# EAGLE design pH_to_I2C_v20 (EAGLE 7.2.0)
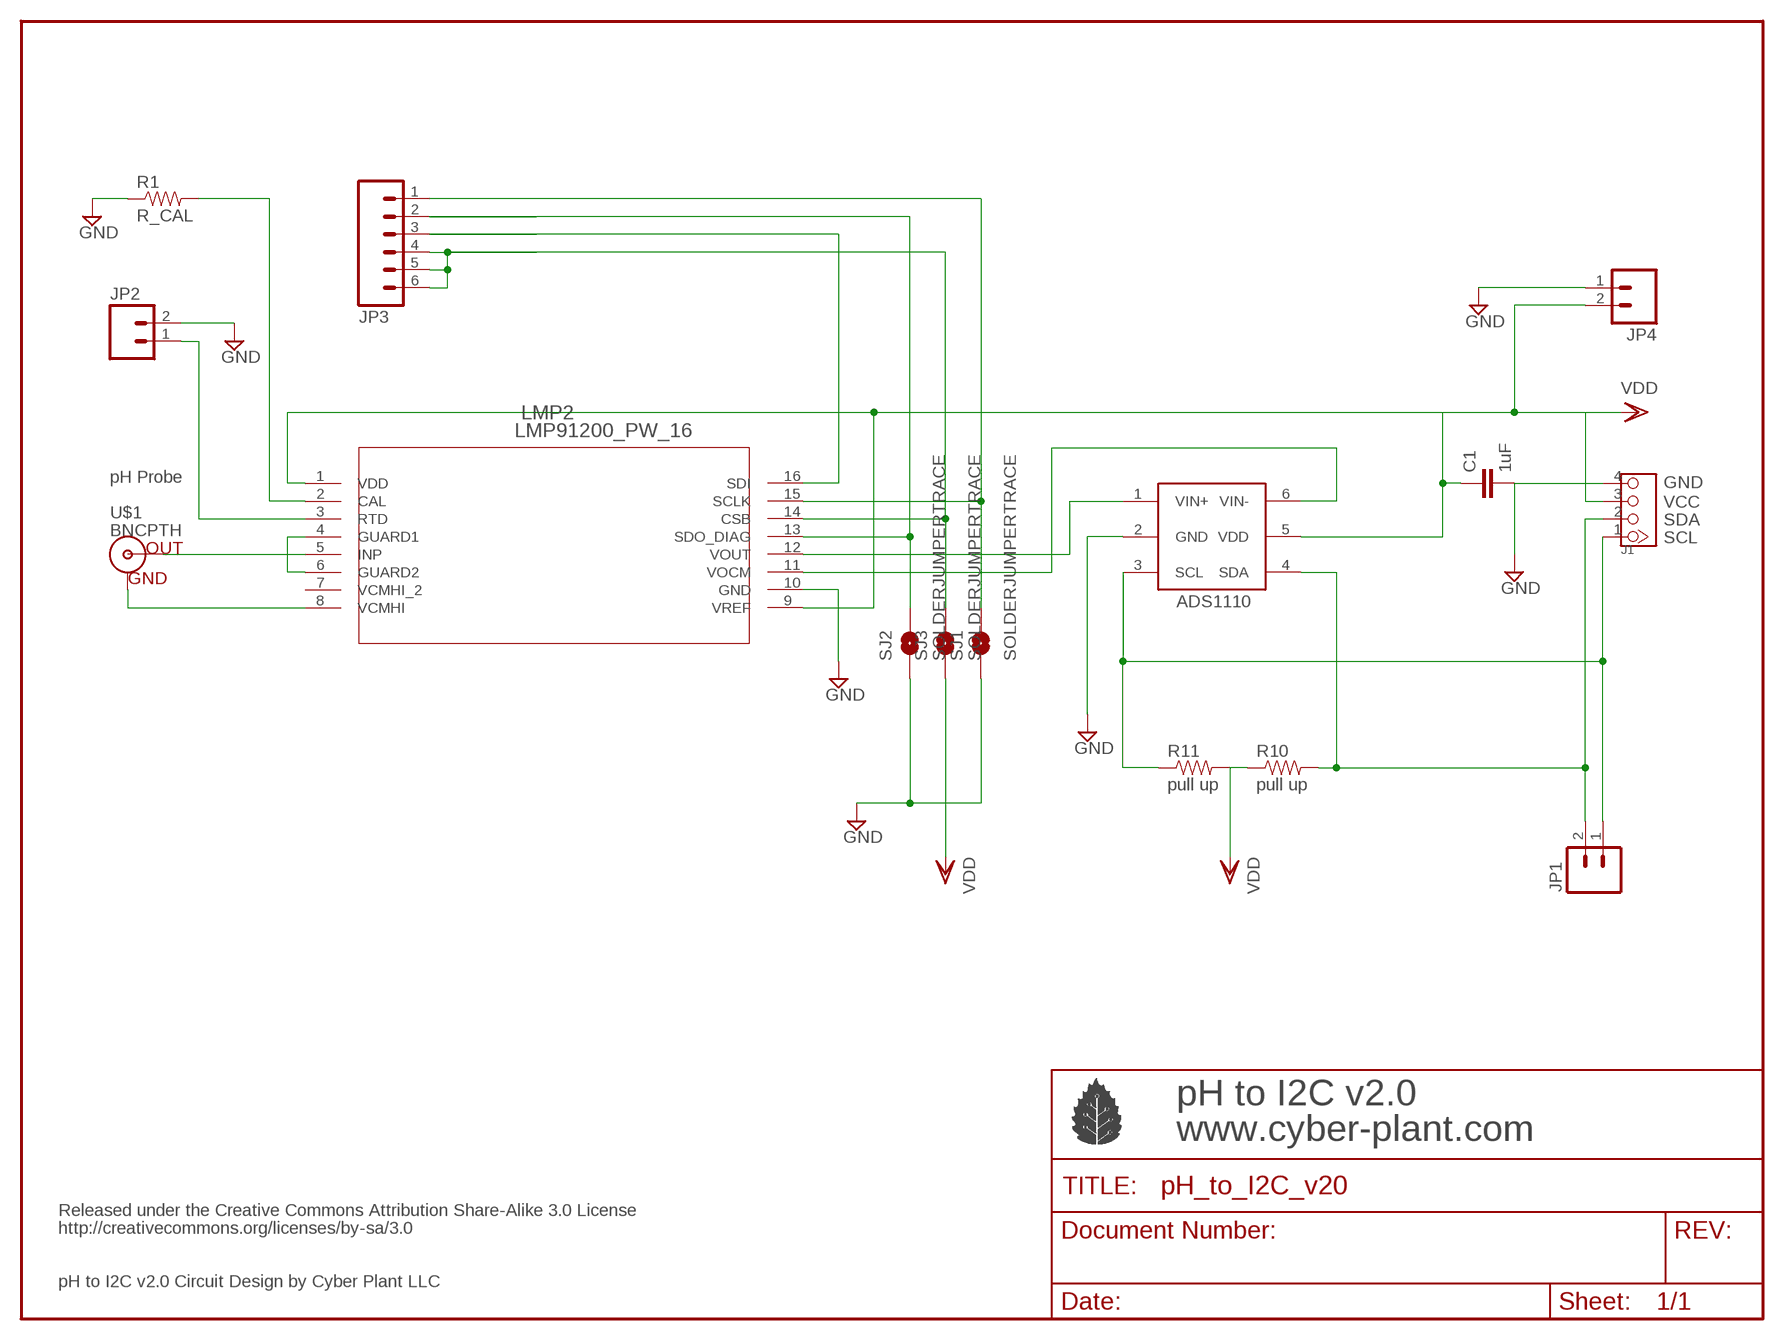
[diagram p0: schematic, sheet 1]

## Parts
C1  1uF  CAP1206  [1206]
IC1  ADS1110  [SOT-23-6]
J1  TWIG-4P-2.090D  [4P-2.0-90D]
JP1  M02PTH  [1X02]
JP2  M02PTH  [1X02]
JP3  M06SIP  [1X06]
JP4  M02PTH  [1X02]
LMP2  LMP91200_PW_16  [MTC16]
R1  R_CAL  RESISTORPTH-1/4W  [AXIAL-0.4]
R10  pull up  RESISTORPTH-1/4W  [AXIAL-0.4]
R11  pull up  RESISTORPTH-1/4W  [AXIAL-0.4]
SJ1  SOLDERJUMPERTRACE  [SJ_2S-TRACE]
SJ2  SOLDERJUMPERTRACE  [SJ_2S-TRACE]
SJ3  SOLDERJUMPERTRACE  [SJ_2S-TRACE]
U$1  BNCPTH  [BNC]

## Nets
GND: C1.2 IC1.2(GND) J1.4 JP2.2 JP4.1 LMP2.10(GND) R1.P$1 SJ1.1 SJ2.1
N$1: JP3.1 LMP2.15(SCLK) SJ1.2
N$2: JP3.2 LMP2.13(SDO_DIAG) SJ2.2
N$3: IC1.4(SDA) J1.2 JP1.2 R10.P$2
N$4: IC1.1(VIN+) LMP2.12(VOUT)
N$5: IC1.6(VIN-) LMP2.11(VOCM)
N$6: IC1.3(SCL) J1.1 JP1.1 R11.P$1
N$13: JP3.4 JP3.5 JP3.6 LMP2.14(CSB) SJ3.2
N$14: JP2.1 LMP2.3(RTD)
N$15: LMP2.8(VCMHI) U$1.GND
N$16: LMP2.5(INP) U$1.S(OUT)
N$17: LMP2.2(CAL) R1.P$2
N$18: LMP2.4(GUARD1) LMP2.6(GUARD2)
N$19: JP3.3 LMP2.16(SDI)
VDD: C1.1 IC1.5(VDD) J1.3 JP4.2 LMP2.1(VDD) LMP2.9(VREF) R10.P$1 R11.P$2 SJ3.1
Unconnected: LMP2.7(VCMHI_2)

## Notes on the sheet
- pH Probe
- GND
- VCC
- SDA
- SCL
- pH to I2C v2.0
- www.cyber-plant.com
- Released under the Creative Commons Attribution Share-Alike 3.0 License
- http://creativecommons.org/licenses/by-sa/3.0
- pH to I2C v2.0 Circuit Design by Cyber Plant LLC

## Library data of the parts
C1 = SparkFun:CAP: Capacitor Standard 0603 ceramic capacitor, and 0.1" leaded capacitor.
IC1 = ads11xx:ADS1110: Analog/Digital conventer i2c Bus max: 2.048v
J1 = Connector_cp:TWIG-4P-2.0
JP1 JP2 JP4 = SparkFun:M02: Header 2 Standard 2-pin 0.1" header. Use with straight break away headers (SKU : PRT-00116), right angle break away headers (PRT-00553), swiss pins (PRT-00743), machine pins (PRT-00117), and female headers (PRT-00115). Molex polarized connector foot print use with SKU : PRT-08233 with associated crimp pins and housings.
JP3 = SparkFun:M06: Header 6 Standard 6-pin 0.1" header. Use with straight break away headers (SKU : PRT-00116), right angle break away headers (PRT-00553), swiss pins (PRT-00743), machine pins (PRT-00117), and female headers (PRT-00115). Molex polarized connector foot print use with SKU : PRT-08094 with associated crimp pins and housings. NOTES ON THE VARIANTS LOCK and LOCK_LONGPADS... This footprint was designed to help hold the alignment of a through-hole component (i.e. 6-pin header) while soldering it into place. You may notice that each hole has been shifted either up or down by 0.005 of an inch from it's more standard position (which is a perfectly straight line). This slight alteration caused the pins (the squares in the middle) to touch the edges of the holes. Because they are alternating, it causes a "brace" to hold the component in place. 0.005 has proven to be the perfect amount of "off-center" position when using our standard breakaway headers. Although looks a little odd when you look at the bare footprint, once you have a header in there, the alteration is very hard to notice. Also, if you push a header all the way into place, it is covered up entirely on the bottom side. This idea of altering the position of holes to aid alignment will be further integrated into the Sparkfun Library for other footprints. It can help hold any component with 3 or more connection pins.
LMP2 = LMP91200:LMP91200_PW_16; BASEPN: LMP91200; DATASHEETURL: http://www.ti.com/lit/ds/symlink/lmp91200.pdf; DESCRIPTION: Configurable AFE for Low-Power Chemical Sensing Applications; MANUFACTURER: Texas Instruments; MANUFACTURER_PART_NUMBER: lmp91200_pw_16; NSC_PACKAGEREFERENCE: MTC16; VENDOR: Texas Instruments
R1 R10 R11 = SparkFun:RESISTOR: Resistor Basic schematic elements and footprints for 0603, 1206, and PTH resistors.; PROD_ID: RES-00824
SJ1-SJ3 = SparkFun:SOLDERJUMPER: Solder Jumper Standard SMD solder jumper. Used to automate production. Two varients : Normally Open and Normally Closed are the same, but have different paste layers. NC will have a large amount of paste and should jumper during reflow.
U$1 = SparkFun:BNC: BNC Connector, Mouser Part# 5227161

## Board
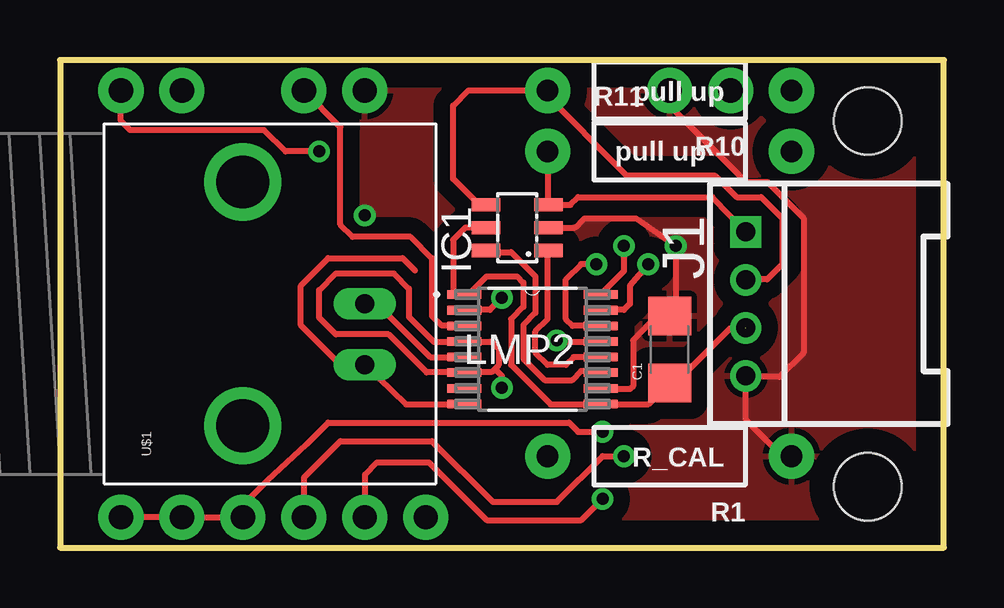
[diagram p1: board, top side]
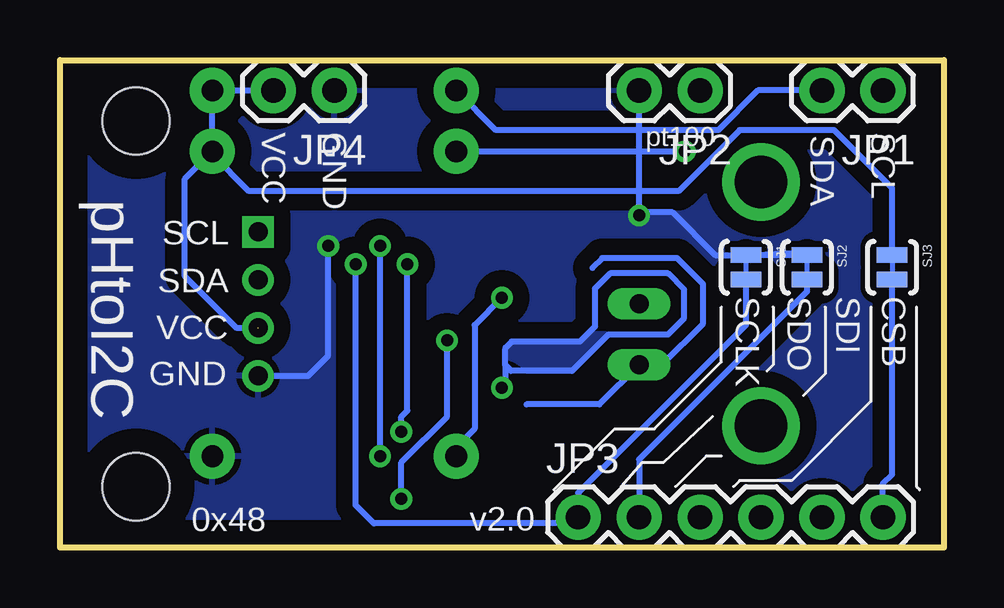
[diagram p2: board, bottom side, seen from below]

Size 36.83 x 20.32 mm. Coordinates in mm from the lower left corner, seen from the top.
Outline: 0,20.32 0,0 36.83,0 36.83,20.32 0,20.32
Copper layers (1*16): Top 0.035mm / dielectric 1.5mm / Bottom 0.035mm
Design rules "default *": minimum track width 6mil, minimum drill 12mil, track to track 27mil, track to pad 10mil, pad to pad 10mil, via to via 10mil, smd to smd 10mil, copper to edge 40mil, drill to drill 12mil, minimum pad ring 10mil, minimum via ring 8mil, stop-mask expansion 4mil, vias tented up to drill 20mil, thermal gap 10mil
Holes 2.8 mm at 33.66,17.78 33.66,2.54

### Footprints (pad centres in the part's own frame; a part is rotated, then mirrored left to right if it is on the bottom)
1206 = smd 1.6 x 1.8: 1 -1.4,0; 2 1.4,0
SOT-23-6 = smd 0.55 x 1.2: 1 -0.95,-1.3; 2 0,-1.3; 3 0.95,-1.3; 4 0.95,1.3; 5 0,1.3; 6 -0.95,1.3
4P-2.0-90D = drill 0.8 pad 1.27 square: 1 -3,0 | drill 0.8 pad 1.27: 2 -1,0; 3 1,0; 4 3,0
1X02 = drill 1.016 pad 1.88: 1 0,0; 2 2.54,0
1X06 = drill 1.016 pad 1.88: 1 0,0; 2 2.54,0; 3 5.08,0; 4 7.62,0; 5 10.16,0; 6 12.7,0
MTC16 = smd 1.422 x 0.356: 1 -2.845,2.286; 2 -2.845,1.626; 3 -2.845,0.965; 4 -2.845,0.33; 5 -2.845,-0.33; 6 -2.845,-0.965; 7 -2.845,-1.626; 8 -2.845,-2.286; 9 2.845,-2.286; 10 2.845,-1.626; 11 2.845,-0.965; 12 2.845,-0.33; 13 2.845,0.33; 14 2.845,0.965; 15 2.845,1.626; 16 2.845,2.286
AXIAL-0.4 = drill 0.9 pad 1.88: P$1 -5.08,0; P$2 5.08,0
SJ_2S-TRACE = smd 0.635 x 1.27: 1 -0.508,0; 2 0.508,0
BNC = drill 2.2: 3 -5.08,5.08; 4 5.08,5.08 | drill 0.8 long: GND -2.54,0; S 0,0

### Placement (x,y rotation side)
C1  25.4,8.25 90 top
IC1  19.05,13.34 90 top
J1  28.57,10.16 270 top
JP1  2.54,19.05 180 bottom
JP2  10.16,19.05 180 bottom
JP3  15.24,1.27 0 bottom
JP4  25.4,19.05 180 bottom
LMP2  19.68,8.27 0 top
R1  25.4,3.81 180 top
R10  25.4,19.05 180 top
R11  25.4,16.51 0 top
SJ1  8.25,11.68 270 bottom
SJ2  5.71,11.68 270 bottom
SJ3  2.16,11.68 270 bottom
U$1  12.7,10.16 90 top

### Tracks (layer width: path | path; a pad name or v marks a point on that pad's centre or on a via)
GND  (via drill 0.5)
  Top 0.254: 25.65,9.91 v25.65,12.57 24,13.72 21.84,13.72 21.46,13.34 IC1.2 | LMP2.10 22.57,6.6 23.75,6.6 23.88,6.73 23.88,8.64 24.89,9.66 C1.2 25.65,9.91 | 25.91,10.16 25.65,9.91 | JP4.1 25.4,18.41 28.57,15.24 29.46,15.24 30.99,13.72 30.99,8.13 29.97,7.11 28.62,7.11 J1.4 28.57,5.33 30.1,3.81 R1.P$1
  Bottom 0.254: SJ1.1 SJ2.1 5.84,12.32 SJ1.1 | J1.4 26.49,7.16 25.65,8 v25.65,12.57 | SJ1.1 9.52,12.19 11.3,13.97 12.57,13.97 v12.7,13.84 JP2.2
  pour Top (isolate 0.61): 0,20.32 36.83,20.32 36.83,0 0,0
  pour Bottom (isolate 0.61): 0,20.32 36.83,20.32 36.83,0 0,0
N$1  (via drill 0.5)
  Top 0.254: v24.51,11.81 23.75,10.92 23.75,10.16 23.49,9.91 22.54,9.91 LMP2.15
  Bottom 0.254: SJ1.2 8.25,9.27 15.24,2.29 JP3.1 15.24,1.02 23.75,1.02 24.51,1.78 v24.51,11.81
N$2  (via drill 0.5)
  Top 0.254: LMP2.13 22.44,8.59 20.7,8.59 v20.7,8.64 | v22.61,2.03 21.72,1.14 17.78,1.14 15.37,3.56 13.21,3.56 12.7,3.05 JP3.2
  Bottom 0.254: SJ2.2 5.71,10.67 12.7,3.68 JP3.2 | v22.61,2.03 22.61,3.56 20.7,5.46 v20.7,8.64
N$3
  Top 0.254: IC1.4 17.46,14.29 16.38,15.37 16.38,18.41 17.02,19.05 R10.P$2 20.07,19.05 23.62,15.49 27.3,15.49 28.19,14.61 29.21,14.61 30.1,13.72 30.1,11.81 29.46,11.18 28.59,11.18 J1.2
  Bottom 0.254: JP1.2 7.75,19.05 9.4,17.4 18.67,17.4 R10.P$2
N$4
  Top 0.254: LMP2.12 21.4,7.94 21.08,7.62 20.32,7.62 19.81,8.13 19.81,9.02 20.32,9.53 20.32,12.36 IC1.1
N$5
  Top 0.254: IC1.6 17.62,12.48 17.53,12.32 18.8,12.32 19.81,11.3 19.81,9.78 19.3,9.27 19.3,7.87 20.19,6.99 21.34,6.99 21.72,7.37 22.47,7.37 LMP2.11
N$6  (via drill 0.5)
  Top 0.254: J1.1 27.18,14.61 21.59,14.61 21.27,14.29 IC1.3 20.32,14.32 R11.P$1 | v10.8,16.51 9.4,16.51 8.51,17.4 2.92,17.4 2.54,17.78 JP1.1
  Bottom 0.254: R11.P$1 v10.8,16.51
N$7
  Top 0.254: 16.51,7.3 15.28,7.3 13.69,8.89 11.49,8.89 10.8,9.59 10.8,10.73 11.49,11.43 13.91,11.43 14.54,10.8 14.54,9.61 15.58,8.57 16.83,8.57
N$9  (via drill 0.5)
  other vias: 18.41,6.67
N$10
  Bottom 0.254: 18.26,8.33 18.01,8.59 15.16,8.59 14.54,9.21 14.54,10.8 13.91,11.43 11.49,11.43 10.82,10.76 10.82,9.56 11.49,8.89 13.97,8.89 15.49,7.37 18.03,7.37 18.29,7.62 | 18.29,7.62 18.29,8.25 | 18.29,7.62 18.29,6.86 18.41,6.73
  pour Bottom: 14.73,8.89 15.16,8.59 18.01,8.59 18.29,8.31 18.29,7.62 18.03,7.37 15.49,7.37 13.97,8.89
N$11
  Bottom 0.152: 11.75,7.67 11.75,7.62
  Bottom 0.254: 12.65,7.67 11.75,7.67 | 11.75,7.62 10.03,9.34 10.03,10.99 11.11,12.07 14.24,12.07 14.64,11.66
N$12
  Top 0.254: 12.57,7.62 11.68,7.62 10.03,9.27 10.03,10.92 11.18,12.07 14.27,12.07 14.78,11.56
N$13  (via drill 0.5)
  Top 0.254: LMP2.14 22.34,9.25 21.36,9.25 21.08,9.53 21.08,11.18 21.72,11.81 v22.35,11.81 | v22.61,4.83 21.59,4.83 21.21,5.21 11.18,5.21 10.29,4.32 8.64,2.79 7.62,1.78 JP3.4 JP3.5 JP3.6
  Bottom 0.254: v22.61,4.83 22.61,5.46 22.35,5.71 v22.35,11.81 | JP3.6 2.54,2.67 2.16,3.05 SJ3.2
N$14
  Top 0.254: LMP2.3 16.8,9.27 15.88,9.27 15.49,9.65 15.49,12.07 14.6,12.95 12.19,12.95 11.68,13.46 11.68,17.53 JP2.1
N$15
  Top 0.152: 16.89,5.97 LMP2.8
  Top 0.254: 16.89,5.97 14.41,5.97 U$1.GND
  Bottom 0.254: U$1.GND 14.35,5.97 17.4,5.97
N$16
  Top 0.152: U$1.S 12.83,10.16
  Top 0.254: 12.83,10.16 13.21,10.16 15.43,7.94 LMP2.5
N$17  (via drill 0.5)
  Top 0.254: v18.41,10.41 17.91,9.91 LMP2.2
  Bottom 0.254: v18.41,10.41 19.56,9.27 19.56,4.95 20.32,4.19 R1.P$2
N$18
  Top 0.152: LMP2.6 | 16.81,8.59 LMP2.4
  Top 0.254: 16.81,8.59 17.98,8.59 18.27,8.29 18.27,7.61 17.98,7.32 LMP2.6
N$19  (via drill 0.5)
  Top 0.254: 22.48,10.61 LMP2.16 23.49,11.52 v23.49,12.57 | v23.49,3.81 22.61,3.81 20.7,1.91 18.03,1.91 15.49,4.44 11.68,4.44 10.16,2.92 JP3.3
  Bottom 0.254: v23.49,3.81 v23.49,12.57
N$20
  Top 0.254: 18.16,7.42 18.41,7.16 18.41,6.73
VDD  (1 unrouted)
  Top 0.152: 16.89,10.54 LMP2.1 | 25.78,6.35 25.4,6.73 C1.1 25.74,6.41 25.78,6.35
  Top 0.254: C1.1 24.53,5.98 LMP2.9 22.52,5.97 20.45,5.97 18.8,7.62 18.8,9.53 19.3,10.03 19.3,11.05 19.05,11.3 17.78,11.3 17.02,10.54 16.89,10.54 16.51,10.54 | 25.74,6.41 26.16,7.37 27.96,9.16 J1.3 | IC1.5 16.89,13.34 16.38,12.83 16.38,10.63 LMP2.1
  Bottom 0.254: SJ3.1 2.16,14.99 4.57,17.4 8.51,17.4 11.05,14.86 28.96,14.86 30.48,16.38 R11.P$2 | J1.3 29.46,9.14 31.62,11.3 31.62,15.37 R11.P$2 | R11.P$2 R10.P$1 JP4.2

### Text on the board
bPlace: SCL | SDA | pt100 | GND | VCC | SCL | SDA | CSB | SDI | SDO | SCLK | pHtoI2C | VCC | GND | v2.0 | 0x48